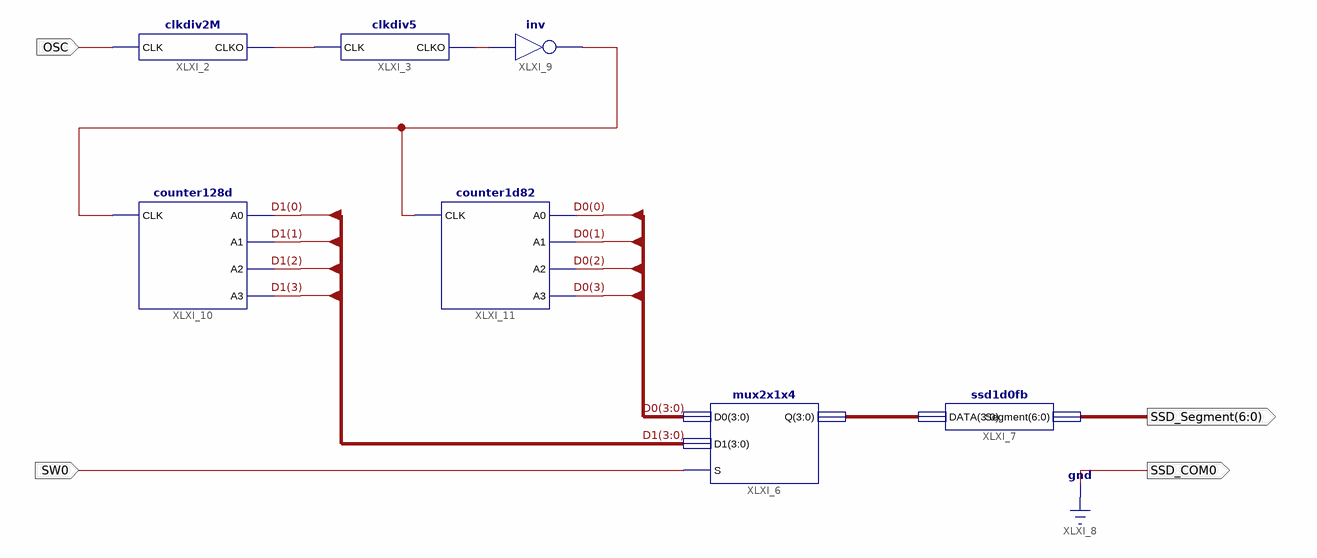
[diagram p0: schematic sheet 1]
// Xilinx ISE schematic main.sch (spartan6) as structural Verilog: 7 symbols, 4 ports
module main (
  input  OSC,
  input  SW0,
  output [6:0] SSD_Segment,
  output SSD_COM0
);

  wire XLXN_1, XLXN_20, XLXN_21;
  wire [3:0] D0, D1, XLXN_16;

  clkdiv2M XLXI_2 (.CLK(OSC), .CLKO(XLXN_1));
  clkdiv5 XLXI_3 (.CLK(XLXN_1), .CLKO(XLXN_21));
  mux2x1x4 XLXI_6 (.D0(D0), .D1(D1), .Q(XLXN_16), .S(SW0));
  ssd1d0fb XLXI_7 (.DATA(XLXN_16), .Segment(SSD_Segment));
  not XLXI_9 (XLXN_20, XLXN_21);
  counter128d XLXI_10 (.A0(D1[0]), .A1(D1[1]), .A2(D1[2]), .A3(D1[3]), .CLK(XLXN_20));
  counter1d82 XLXI_11 (.A0(D0[0]), .A1(D0[1]), .A2(D0[2]), .A3(D0[3]), .CLK(XLXN_20));

  assign SSD_COM0 = 1'b0;
endmodule
